# EAGLE design tvbgone-attiny85-pendant (EAGLE 5.11)
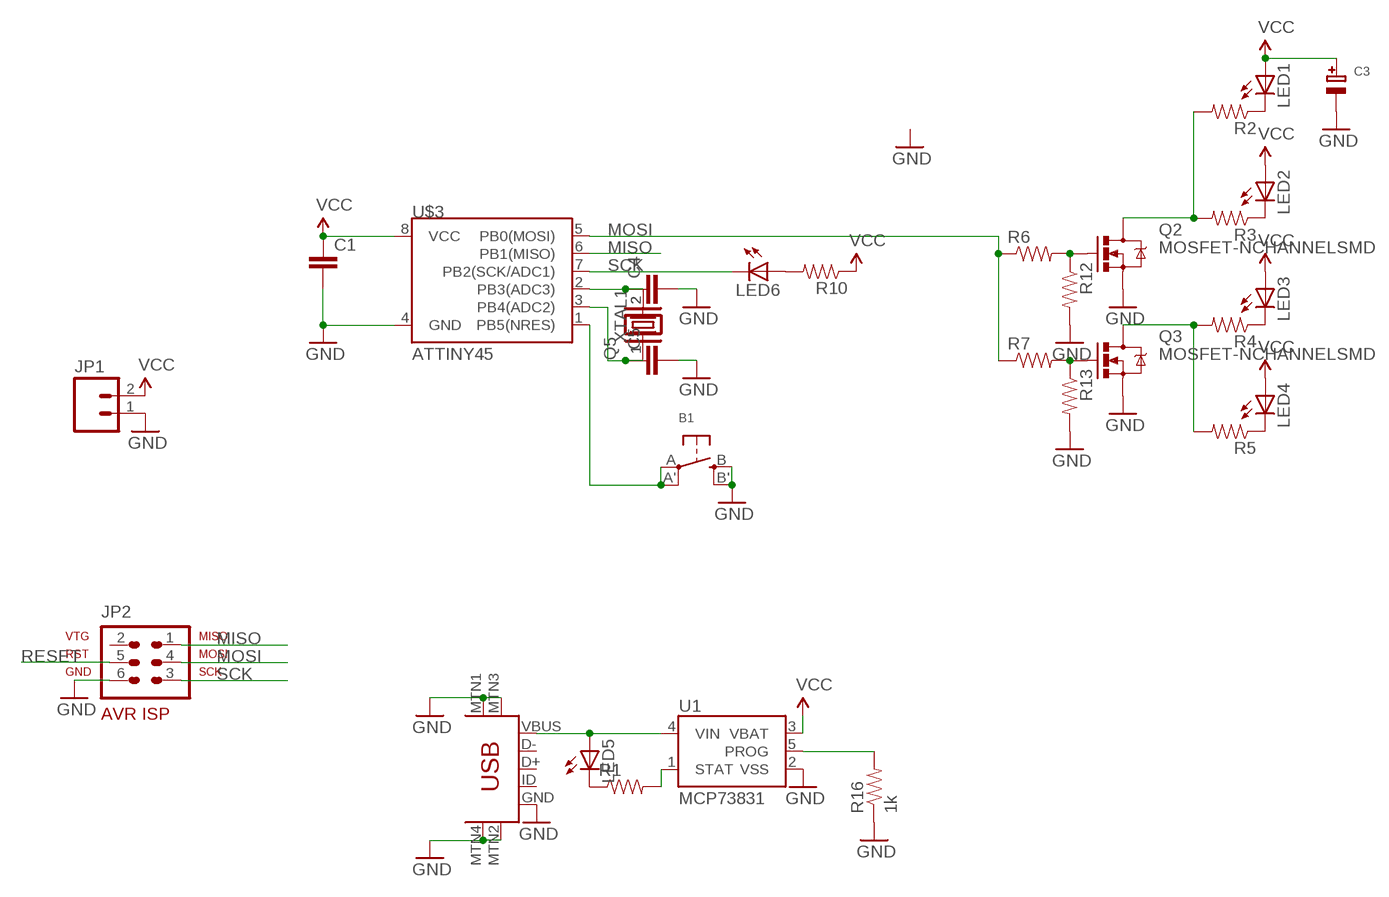
[diagram p0: schematic, sheet 1]

## Parts
B1  SWITCH_TACT_SMT  [EVQ-Q2]
C1  CAP0603-CAP  [0603-CAP]
C3  CAP_TANTALUMD/7343_WAVE  [EIA7343-31/D-W]
C4  CAP0603-CAP  [0603-CAP]
C5  CAP0603-CAP  [0603-CAP]
JP1  M02PTH3  [1X02_LONGPADS]
JP2  AVR-ISP-6  [AVR-ISP-6]
LED1  LED5MM  [LED5MM]
LED2  LED5MM  [LED5MM]
LED3  LED5MM  [LED5MM]
LED4  LED5MM  [LED5MM]
LED5  LEDCHIP-LED0805  [CHIP-LED0805]
LED6  LEDCHIPLED_0805  [CHIPLED_0805]
Q2  MOSFET-NCHANNELSMD  [SOT23-3]
Q3  MOSFET-NCHANNELSMD  [SOT23-3]
Q5  XTAL/S  [QS]
R1  RESISTOR0603-RES  [0603-RES]
R2  RESISTOR0603-RES  [0603-RES]
R3  RESISTOR0603-RES  [0603-RES]
R4  RESISTOR0603-RES  [0603-RES]
R5  RESISTOR0603-RES  [0603-RES]
R6  RESISTOR0603-RES  [0603-RES]
R7  RESISTOR0603-RES  [0603-RES]
R10  RESISTOR0603-RES  [0603-RES]
R12  RESISTOR0603-RES  [0603-RES]
R13  RESISTOR0603-RES  [0603-RES]
R16  1k  RESISTOR0603-RES  [0603-RES]
U1  MCP73831  [SOT23-5]
U$3  ATTINY45  [SO08-EIAJ]
U$4  USB-MINIB-5PIN  [USB-MINIB]
XTAL1  OSC-XTAL-HC-49U-SMD  [HC-49U]

## Nets
GND: B1.B'(S1) B1.B(S) C1.2 C3.- C4.2 C5.2 JP1.1 JP2.6 Q2.2(S) Q3.2(S) R12.2 R13.2 R16.1 U1.2(VSS) U$3.4(GND) U$4.GND U$4.MTN1(MTN2) U$4.MTN2(MTN3) U$4.MTN3(MTN1) U$4.MTN4
MISO: JP2.1 U$3.6(PB1(MISO))
MOSI: JP2.4 R6.1 R7.1 U$3.5(PB0(MOSI))
N$1: LED1.K(C) R2.1
N$2: LED2.K(C) R3.1
N$3: LED3.K(C) R4.1
N$4: LED4.K(C) R5.1
N$6: Q2.1(G) R6.2 R12.1
N$7: Q3.1(G) R7.2 R13.1
N$10: Q2.3(D) R2.2 R3.2
N$11: Q3.3(D) R4.2 R5.2
N$13: LED6.A R10.2
N$14: LED5.A U1.4(VIN) U$4.VBUS
N$15: C4.1 Q5.2 U$3.2(PB3(ADC3)) XTAL1.2
N$16: C5.1 Q5.1 U$3.3(PB4(ADC2)) XTAL1.1
N$17: LED5.C R1.1
N$19: R1.2 U1.1(STAT)
N$21: R16.2 U1.5(PROG)
RESET: B1.A'(P1) B1.A(P) JP2.5 U$3.1(PB5(NRES))
SCK: JP2.3 LED6.C U$3.7(PB2(SCK/ADC1))
VCC: C1.1 C3.+ JP1.2 LED1.A LED2.A LED3.A LED4.A R10.1 U1.3(VBAT) U$3.8(VCC)
Unconnected: JP2.2 U$4.D+ U$4.D- U$4.ID

## Library data of the parts
B1 = microbuilder:SWITCH_TACT_SMT: SMT Tact Switches 6x6mm - Digikey: P12940SCT-ND KMR2 (4.6x2.8mm) - Digikey: 401-1426-1-ND EVQ-PQHB55 - Light Touch, 160GF (4.5x4.5mm) - Digikey: P8090SCT-ND
C1 C4 C5 = SparkFun:CAP: Capacitor Standard 0603 ceramic capacitor, and 0.1" leaded capacitor.
C3 = microbuilder:CAP_TANTALUM: Tantalum Capacitors Wave footprints have larger pads and are meant to be used for hand soldering. Reflow footprints are optimised for solder paste and a reflow oven. EIA3216-18/A-[R/W] - Size A / 3216-18 / 1206 footprint 4.7µF 25V 10% Tantalum Capacitor 10µF 16V 10% Tantalum Capacitor [Digikey: 495-2236-2-ND] EIA3528-21/B-[R/W] - Size B / 3528-21 47µF 10V 10% Tantalum Capactior [Digikey: 495-2216-1-ND] EIA6032-28/C-[R/W] - Size C / 6032-28 10µF 35V 20% Tantalum Capacitor [Digikey: 495-2285-1-ND] 100µF 16V 10% Tantalum Capactior [Digikey: 399-5214-1-ND]
JP1 = SparkFun:M02: Header 2 Standard 2-pin 0.1" header. Use with straight break away headers (SKU : PRT-00116), right angle break away headers (PRT-00553), swiss pins (PRT-00743), machine pins (PRT-00117), and female headers (PRT-00115). Molex polarized connector foot print use with SKU : PRT-08233 with associated crimp pins and housings.
JP2 = avr-5:AVR-ISP-6: AVR ISP-6 Serial Programming Header
LED1-LED4 = SparkFun:LED: LEDs Standard schematic elements and footprints for 5mm, 3mm, 1206, and 0603 sized LEDs. 5mm - Spark Fun Electronics SKU : COM-00529 (and others)
LED5 LED6 = adafruit:LED: LED OSRAM: - CHIPLED LG R971, LG N971, LY N971, LG Q971, LY Q971, LO R971, LY R971 LH N974, LH R974 LS Q976, LO Q976, LY Q976 LO Q996 - Hyper CHIPLED LW Q18S LB Q993, LB Q99A, LB R99A - SideLED LS A670, LO A670, LY A670, LG A670, LP A670 LB A673, LV A673, LT A673, LW A673 LH A674 LY A675 LS A676, LA A676, LO A676, LY A676, LW A676 LS A679, LY A679, LG A679 - Hyper Micro SIDELED® LS Y876, LA Y876, LO Y876, LY Y876 LT Y87S - SmartLED LW L88C, LW L88S LB L89C, LB L89S, LG L890 LS L89K, LO L89K, LY L89K LS L896, LA L896, LO L896, LY L896 - TOPLED LS T670, LO T670, LY T670, LG T670, LP T670 LSG T670, LSP T670, LSY T670, LOP T670, LYG T670 LG T671, LOG T671, LSG T671 LB T673, LV T673, LT T673, LW T673 LH T674 LS T676, LA T676, LO T676, LY T676, LB T676, LH T676, LSB T676, LW T676 LB T67C, LV T67C, LT T67C, LS T67K, LO T67K, LY T67K, LW E67C LS E67B, LA E67B, LO E67B, LY E67B, LB E67C, LV E67C, LT E67C LW T67C LS T679, LY T679, LG T679 LS T770, LO T770, LY T770, LG T770, LP T770 LB T773, LV T773, LT T773, LW T773 LH T774 LS E675, LA E675, LY E675, LS T675 LS T776, LA T776, LO T776, LY T776, LB T776 LHGB T686 LT T68C, LB T68C - Hyper Mini TOPLED® LB M676 - Mini TOPLED Santana® LG M470 LS M47K, LO M47K, LY M47K Source: http://www.osram.convergy.de/
Q2 Q3 = SparkFun:MOSFET-NCHANNEL
Q5 = special:XTAL/S: CRYSTAL
R1-R7 R10 R12 R13 R16 = SparkFun:RESISTOR: Resistor Basic schematic elements and footprints for 0603, 1206, and PTH resistors.
U1 = SparkFun:MCP73831: Microchip's MCP73831 Miniature single cell, fully integrated Li-Ion, Li-polymer charge management controller http://ww1.microchip.com/downloads/en/DeviceDoc/21984a.pdf
U$3 = SparkFun:ATTINY45: Atmel ATTiny45
U$4 = SparkFun:USB-MINIB: Mini-USB "B" connector with 5th pin broken out. Created new symbol breaking out 5th "ID" pin in mini/micro USB connector spec. See: http://en.wikipedia.org/wiki/Mini_usb#Cables. Uses same footprint as 4-pin symbol. Also added pins to connect to mounting / shield pads if required (probably not generally needed as signals aren't shielded once they leave the connector).
XTAL1 = dp_devices:OSC-XTAL

## Board
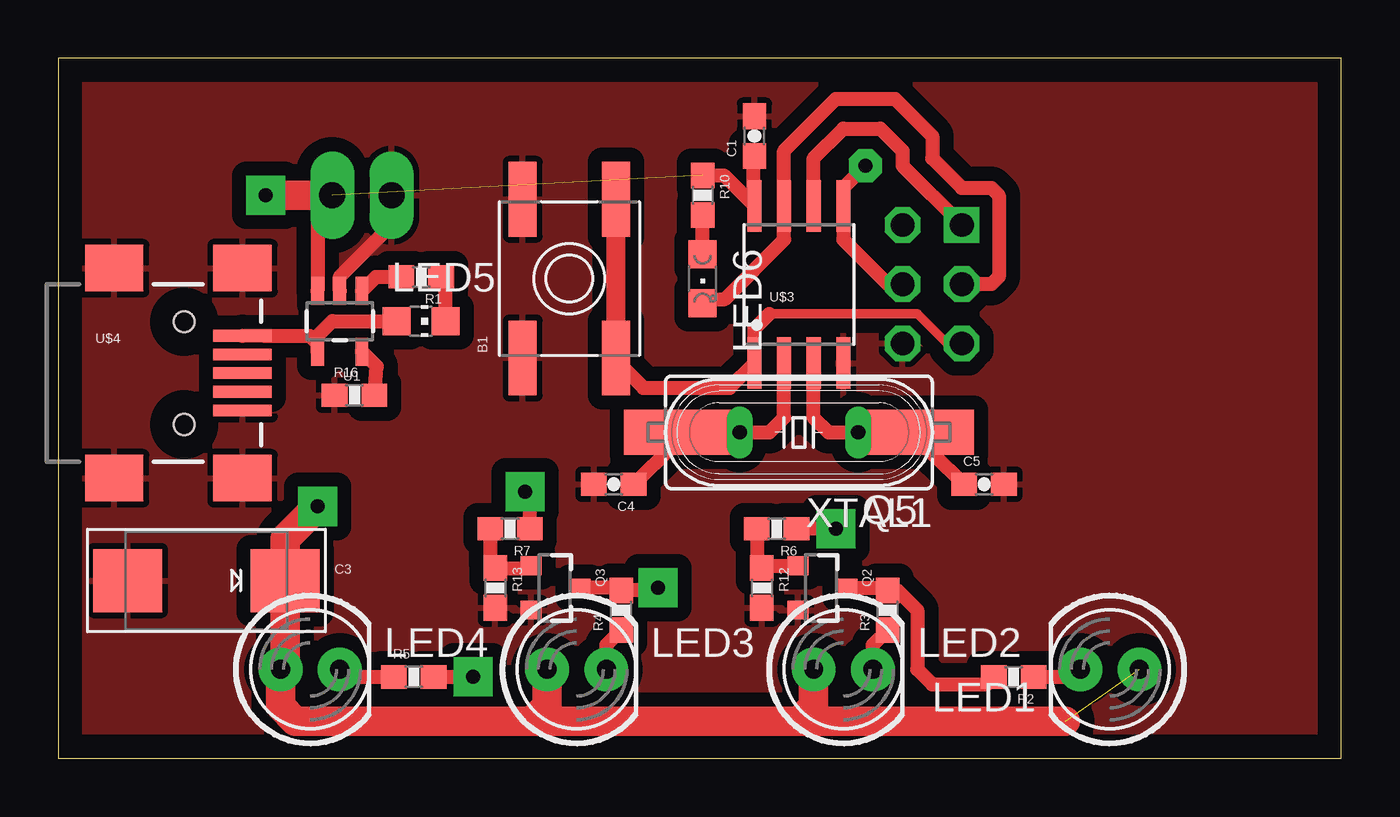
[diagram p1: board, top side]
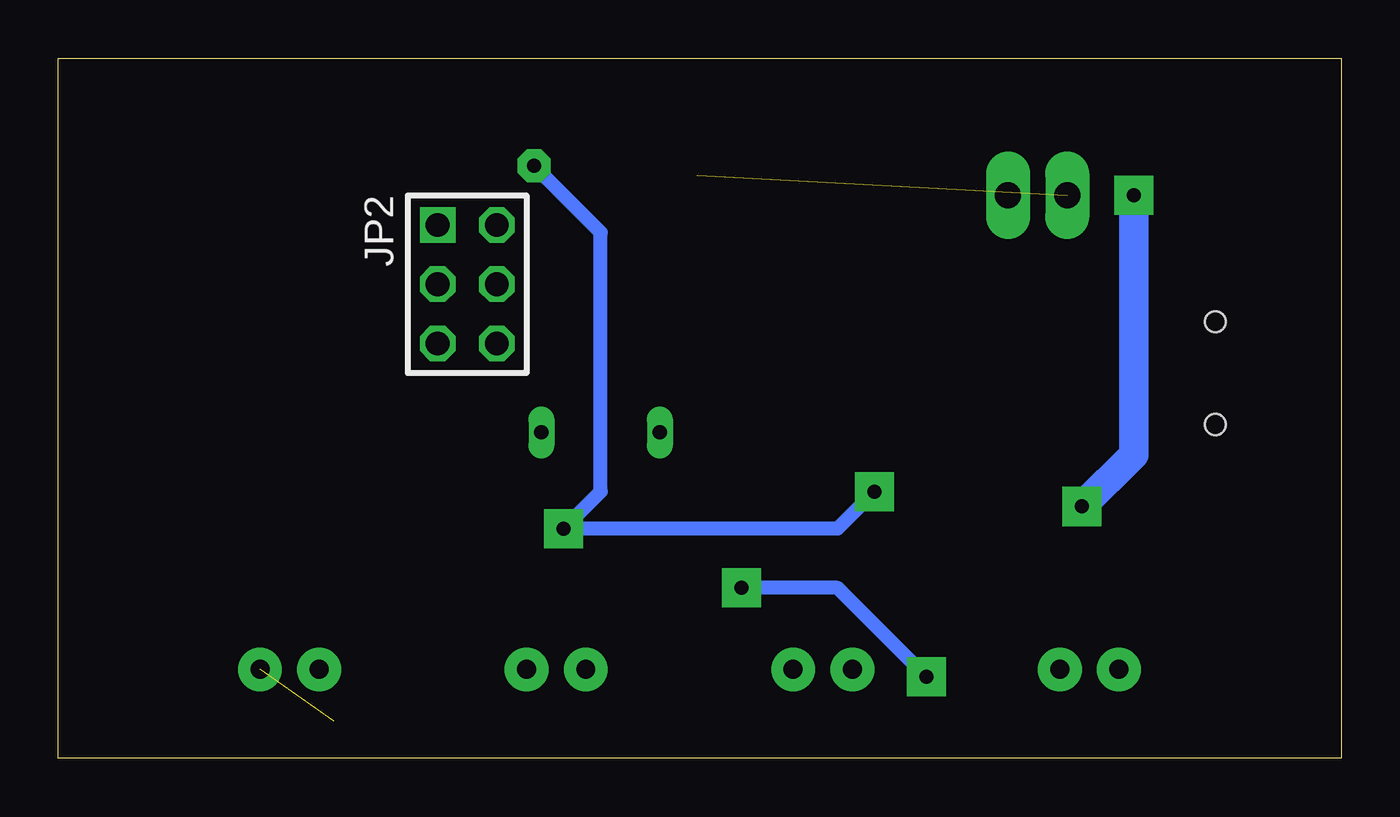
[diagram p2: board, bottom side, seen from below]

Size 55 x 30 mm. Coordinates in mm from the lower left corner, seen from the top.
Outline: 0,0 55,0 55,30 0,30 0,0
Copper layers (1*16): Top 0.035mm / dielectric 1.5mm / Bottom 0.035mm
Design rules "default": minimum track width 10mil, minimum drill 24mil, track to track 8mil, track to pad 8mil, pad to pad 8mil, via to via 8mil, smd to smd 8mil, copper to edge 40mil, drill to drill 8mil, minimum pad ring 10mil, minimum via ring 8mil, stop-mask expansion 4mil, vias tented up to drill 0mil, thermal gap 10mil

### Footprints (pad centres in the part's own frame; a part is rotated, then mirrored left to right if it is on the bottom)
EVQ-Q2 = smd 3.2 x 1.2: A -3.4,-2; A' 3.4,-2; B -3.4,2; B' 3.4,2
0603-CAP = smd 1.1 x 1: 1 -0.85,0; 2 0.85,0
EIA7343-31/D-W = smd 2.95 x 2.7: + 3.375,0; - -3.375,0
1X02_LONGPADS = drill 1.118 pad 1.88 long: 1 0,0; 2 2.54,0
AVR-ISP-6 = drill 1.016 square: 1 -2.54,-1.27 | drill 1.016 octagon: 2 -2.54,1.27; 3 0,-1.27; 4 0,1.27; 5 2.54,-1.27; 6 2.54,1.27
LED5MM = drill 0.813 pad 1.88 round: A -1.27,0; K 1.27,0
CHIP-LED0805 = smd 1.2 x 1.2: A 0,-1.05; C 0,1.05
CHIPLED_0805 = smd 1.2 x 1.2: A 0,-1.05; C 0,1.05
SOT23-3 = smd 0.8 x 0.9: 1 -0.95,-1; 2 0.95,-1; 3 0,1.1
QS = drill 0.61 long: 1 -2.54,0; 2 2.54,0
0603-RES = smd 1.1 x 1: 1 -0.85,0; 2 0.85,0
SOT23-5 = smd 0.55 x 1.2: 1 -0.95,-1.3; 2 0,-1.3; 3 0.95,-1.3; 4 0.95,1.3; 5 -0.95,1.3
SO08-EIAJ = smd 0.61 x 2.21: 1 -1.905,-3.378; 2 -0.635,-3.378; 3 0.635,-3.378; 4 1.905,-3.378; 5 1.905,3.353; 6 0.635,3.353; 7 -0.635,3.353; 8 -1.905,3.353
USB-MINIB = smd 2.5 x 0.5: D+ 2.5,0; D- 2.5,0.8; GND 2.5,-1.6; ID 2.5,-0.8; VBUS 2.5,1.6 | smd 2.5 x 2: MTN1 -3,4.5; MTN2 2.5,4.5; MTN3 -3,-4.5; MTN4 2.5,-4.5 | hole 0.9: 0,2.2; 0,-2.2
HC-49U = smd 5.334 x 1.93: 1 -4.826,0; 2 4.826,0

### Placement (x,y rotation side)
B1  21.91,20.56 90 top
C1  29.84,26.67 90 top
C3  6.35,7.62 0 top
C4  23.81,11.75 180 top
C5  39.69,11.75 0 top
JP1  14.29,24.13 180 top
JP2  37.47,20.32 270 bottom
LED1  45.09,3.81 180 top
LED2  33.66,3.81 0 top
LED3  22.23,3.81 0 top
LED4  10.79,3.81 0 top
LED5  15.56,18.73 270 top
LED6  27.62,20.56 180 top
Q2  32.7,7.3 270 top
Q3  21.27,7.3 270 top
Q5  31.75,13.97 180 top
R1  15.56,20.64 180 top
R2  40.96,3.49 180 top
R3  35.56,6.35 90 top
R4  24.13,6.35 90 top
R5  15.24,3.49 0 top
R6  30.8,9.84 180 top
R7  19.37,9.84 180 top
R10  27.62,24.13 270 top
R12  30.16,7.3 270 top
R13  18.73,7.3 270 top
R16  12.7,15.56 0 top
U1  12.06,18.73 180 top
U$3  31.75,20.32 0 top
U$4  5.4,16.51 0 top
XTAL1  31.75,13.97 180 top

### Tracks (layer width: path | path; a pad name or v marks a point on that pad's centre or on a via)
GND
  Top 0.61: U1.2 12.06,20.64 14.29,22.86 JP1.1
  pour Top (isolate 0.61): 0,30.48 0,0 54.61,0 54.61,30.48
MISO
  Top 0.61: JP2.1 36.2,25.4 36.2,26.04 35.24,26.99 33.66,26.99 32.38,25.72 U$3.6
MOSI  (via drill 0.6 pad 1.42, 0.6 pad 1.68)
  Top 0.61: v34.61,25.4 33.66,24.45 U$3.5 33.66,22.23 35.56,20.32 JP2.4 | R7.1 20.22,11.21 v20,11.43 | v33.34,9.84 R6.1
  Bottom 0.61: v20,11.43 21.59,9.84 v33.34,9.84 31.75,11.43 31.75,22.54 v34.61,25.4
N$1
  Top 0.61: R2.1 43.5,3.49 LED1.K
N$2
  Top 0.61: LED2.K 34.92,4.87 R3.1
N$3
  Top 0.61: LED3.K 23.5,4.87 R4.1
N$4
  Top 0.61: LED4.K 12.38,3.49 R5.1
N$6
  Top 0.61: Q2.1 30.26,8.25 R12.1 29.95,8.37 R6.2
N$7
  Top 0.61: Q3.1 20.17,8.15 R13.1 18.52,8.37 R7.2
N$10
  Top 0.61: Q2.3 35.46,7.3 R3.2 35.98,7.2 36.83,6.35 36.83,3.81 37.47,3.17 39.79,3.17 R2.2
N$11  (via drill 0.6 pad 1.68)
  Top 0.61: Q3.3 24.03,7.3 R4.2 25.61,7.2 v25.72,7.3 | R5.2 v17.78,3.49
  Bottom 0.61: v17.78,3.49 21.59,7.3 v25.72,7.3
N$13
  Top 0.61: LED6.A R10.2
N$14
  Top 0.61: U1.4 11.12,17.78 10.95,17.94 | 10.95,17.94 10.79,18.1 8.86,18.1 U$4.VBUS | LED5.A 11.75,18.73 10.95,17.94
N$15
  Top 0.61: U$3.2 31.11,14.61 30.48,13.97 Q5.2 26.98,13.97 | 26.98,13.97 XTAL1.2 | C4.1 26.98,13.97
N$16
  Top 0.61: U$3.3 32.38,14.61 33.02,13.97 Q5.1 XTAL1.1 36.58,13.91 C5.1
N$17
  Top 0.61: R1.1 16.61,20.54 LED5.C
N$19
  Top 0.61: U1.1 13.62,20.64 R1.2
N$21
  Top 0.61: U1.5 13.65,16.8 R16.2
RESET
  Top 0.406: JP2.5 38.1,17.78 36.83,19.05 30.48,19.05
  Top 0.61: 30.48,19.05 29.84,18.41 U$3.1 28.78,15.88 25.08,15.88 23.91,17.05 B1.A
  Top 0.813: B1.A B1.A'
SCK
  Top 0.61: JP2.3 40.01,20.32 40.32,20.64 40.32,24.13 40.01,24.45 38.73,24.45 37.47,25.72 37.47,26.67 35.88,28.26 33.34,28.26 31.11,26.04 U$3.7 31.11,22.23 28.57,19.68 27.8,19.68 LED6.C
VCC  (via drill 0.6 pad 1.68)  (2 unrouted)
  Top 0.61: C1.1 29.81,25.78 29.81,23.71 U$3.8 28.54,24.98 R10.1 | U1.3 11.12,23.5 JP1.2
  Top 1.27: 20.32,1.59 10.16,1.59 9.53,2.22 LED4.A 9.72,4.01 C3.+ 9.72,9.41 v11.11,10.79 | 20.32,1.59 31.75,1.59 | 31.75,1.59 43.18,1.59 | LED2.A 32.38,2.22 31.75,1.59 | LED3.A 20.95,2.22 20.32,1.59 | v8.89,24.13 JP1.2
  Bottom 1.27: v11.11,10.79 8.89,13.02 v8.89,24.13